# EasyEDA Pro project ProPrj_Pollux Marine Drone_2026-03-05.epro

# Schematic Schematic1
Board Name: Wristaband; Create Date: 2026-03-01; Page Name: P1; Project Name: Pollux Marine Drone; Schematic Name: Schematic1; Update Date: 2026-03-05; Company: EasyEDA.com; Page Size: A4; Version: V1.0
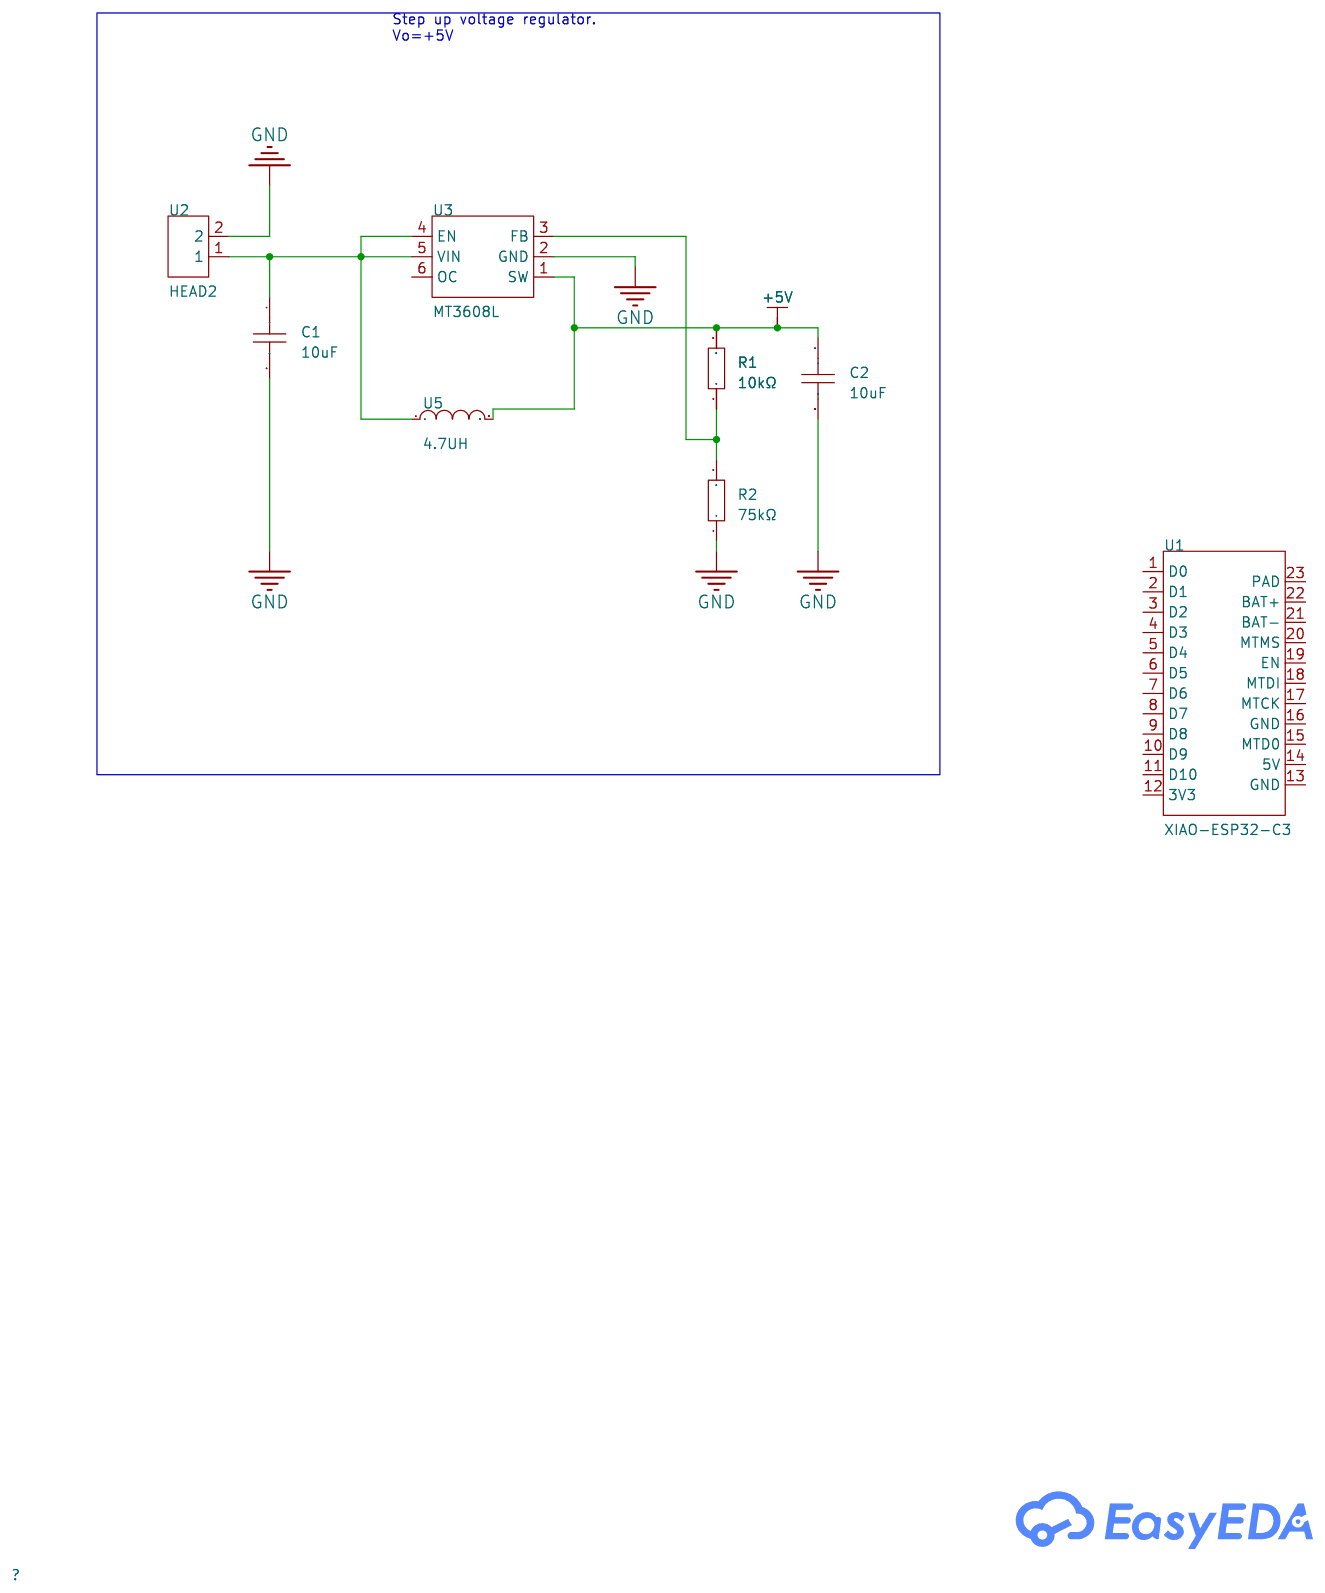
[diagram p0: schematic sheet]

## Parts
C1  10uF  [C0805]
C2  10uF  [C0805]
R1  10kΩ  [R0805]
R2  75kΩ  [R0805]
U1  XIAO-ESP32-C3  [COMM-SMD_XIAO-ESP32-C3_1]
U2  HEAD2  [HDR-TH_2P-P2.54-V-M]
U3  MT3608L  [SOT-23-6_L2.9-W1.6-P0.95-LS2.8-BL_3]
U5  4.7UH  [IND-SMD_L3.5-W3.0]

## Library data of the parts
C1 C2 = 0805X5R106K350NT: Capacitance:10uF Tolerance:±10% Tolerance:±10% Voltage Rating:35V Temperature Coefficient:X5R; LCSC Part Name: 10uF ±10% 35V; Supplier Part: C49326680; Manufacturer: AIDE(爱迪电容); Supplier Footprint: 0805; JLCPCB Part Class: Extended Part; Datasheet: https://item.szlcsc.com/datasheet/0805X5R106K350NT/51802510.html; Supplier: LCSC; Tolerance: ±10%; Voltage Rating: 35V; Temperature Coefficient: X5R
R1 R2 = 0805W8F1002T5E: Type:Thick Film Resistor Resistance:10kΩ Tolerance:±1% Tolerance:±1% Power(Watts):125mW Voltage-Supply(Max):150V Temperature Coefficient:±100ppm/℃ Temperature Coefficient:±100ppm/℃ Operating Temperature:-55℃~+155℃ Operating Temperature:-55℃~+155℃; LCSC Part Name: 10kΩ ±1% 125mW 厚膜电阻; Supplier Part: C17414; Manufacturer: UNI-ROYAL(厚声); Supplier Footprint: 0805; JLCPCB Part Class: Basic Part; Datasheet: https://item.szlcsc.com/datasheet/0805W8F1002T5E/18102.html; Supplier: LCSC; Type: Thick Film Resistor; Tolerance: ±1%; Power(Watts): 125mW; Voltage-Supply(Max): 150V; Temperature Coefficient: ±100ppm/℃; Operating Temperature: -55℃~+155℃
U1 = XIAO-ESP32-C3: Supplier Part: C9900252152; Supplier Footprint: SMD; Supplier: LCSC
U2 = HEAD2: Supplier Part: C9900010030; Supplier Footprint: HDR-TH_2P-P2.54; JLCPCB Part Class: Extended Part; Supplier: LCSC
U3 = MT3608L: Function:Boost Voltage - Supply:2.2V~16V Voltage - Supply:2.2V~16V Output Voltage:- Output Voltage:- Output Current:2.5A Frequency - Switching:1.2MHz Frequency - Switching:1.2MHz Operating Temperature:-40℃~+85℃@(TA) Operating Temperature:-40℃~+85℃@(TA) Sy; LCSC Part Name: 高效2.5A 1.2MHz升压转换器; Supplier Part: C2932326; Manufacturer: 西安航天民芯; Supplier Footprint: SOT-23-6; JLCPCB Part Class: Extended Part; Datasheet: https://item.szlcsc.com/datasheet/MT3608L/3276649.html; Supplier: LCSC; Function: Boost; Voltage - Supply: 2.2V~16V; Output Current: 2.5A; Frequency - Switching: 1.2MHz; Operating Temperature: -40℃~+85℃@(TA); Synchronous Rectifier: No; Number of Outputs: 1; Topology: Boost; Quiescent Current: 100uA; Switch tube (built-in/external): Built-In; Output Type: Adjustable
U5 = 4.7UH_C9900008595: Supplier Part: C9900008595; JLCPCB Part Class: Extended Part; Supplier: LCSC

## Nets
+5V: C2.1 R1.2 U3.1(SW) U5.2
GND: C1.2 C2.2 R2.1 U2.2 U3.2(GND)
Net-(C1-1): C1.1 U2.1 U3.4(EN) U3.5(VIN) U5.1
Net-(R1-1): R1.1 R2.2 U3.3(FB)

Not connected (* = marked no-connect by the designer): U1 1(D0) 2(D1) 3(D2) 4(D3) 5(D4) 6(D5) 7(D6) 8(D7) 9(D8) 10(D9) 11(D10) 12(3V3) 13(GND) 14(5V) 15(MTD0) 16(GND) 17(MTCK) 18(MTDI) 19(EN) 20(MTMS) 21(BAT-) 22(BAT+) 23(PAD); U3 6(OC)

## Notes on the sheet
- Step up voltage regulator.
  Vo=+5V

# Board PCB1
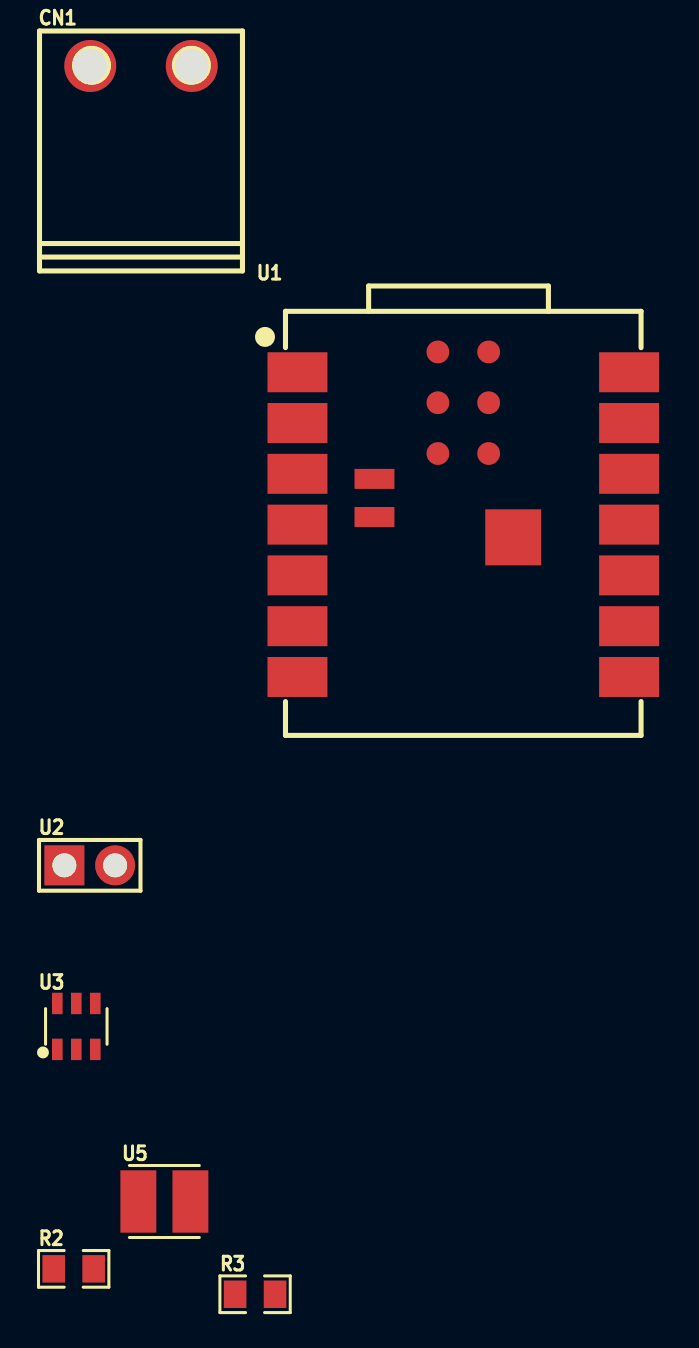
[diagram p1: board, top side]
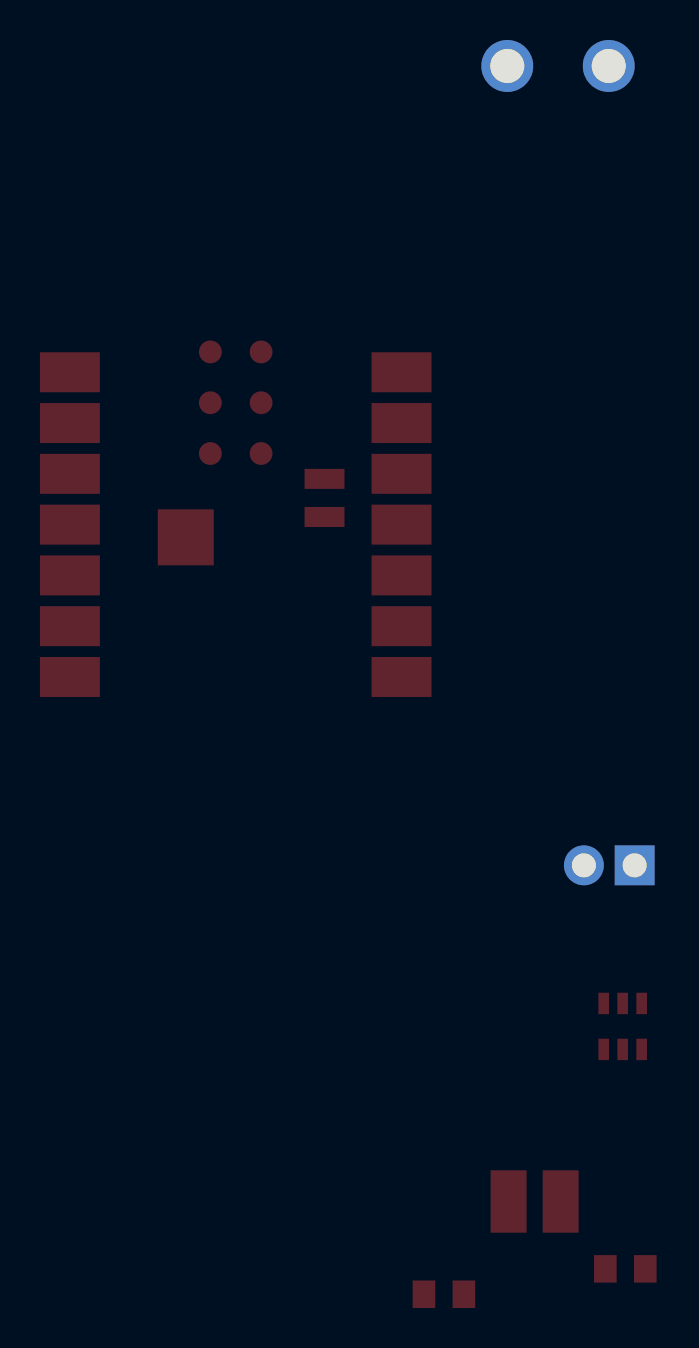
[diagram p2: board, bottom side, seen from below]

No outline. copper layers: Top Layer, Bottom Layer. Coordinates in mm from the lowest, leftmost part position.
Stack: Top Layer 0.035mm / Dielectric1 1.51mm FR4 er 4.5 / Bottom Layer 0.035mm

## Design rules (mm)
template: JLCPCB Capability(Two Layers Board)
spacing copperThickness1oz (default): track to track 0.102, other pairs 0.152 to 0.3
spacing copperThickness2oz: track to track 0.203, other pairs 0.152 to 0.3
track width copperThickness1oz (default): min 0.127, default 0.254, max 2.54
track width copperThickness2oz: min 0.203, default 0.254, max 2.54
differential pair differentialPair (default): width min 0.127, default 0.254, max 2.54; gap min 0.152, default 0.152
via viaSize (default): diameter min 0.5, default 0.61, max 10; hole min 0.3, default 0.305, max 6.3

## Placement (name value [footprint] x y rotation side)
CN1  LC-2P-S-5.08-W  [CONN-TH_2P-P5.08_2EHDR-02P]  3.37 61.43 0 top
R2  75kΩ  [R0805]  0 1.27 0 top
R3  75kΩ  [R0805]  9.08 0 0 top
U1  XIAO-ESP32-C3  [COMM-SMD_XIAO-ESP32-C3_1]  19.5 39 0 top
U2  HEAD2  [HDR-TH_2P-P2.54-V-M]  0.8 21.45 0 top
U3  MT3608L  [SOT-23-6_L2.9-W1.6-P0.95-LS2.8-BL_3]  0.13 13.39 0 top
U5  4.7UH  [IND-SMD_L3.5-W3.0]  4.54 4.64 0 top

## Footprints (pads in the part's own frame, mm; a bottom-side part is the same pattern mirrored in y, then rotated)
COMM-SMD_XIAO-ESP32-C3_1
  rect 3x2 smd: 1(-8.3,7.112) 2(-8.3,4.572) 3(-8.3,2.032) 4(-8.3,-0.508) 5(-8.3,-3.048) 6(-8.3,-5.588) 7(-8.3,-8.128) 8(8.3,-8.128) 9(8.3,-5.588) 10(8.3,-3.048) 11(8.3,-0.508) 12(8.3,2.032) 13(8.3,4.572) 14(8.3,7.112)
  round 1.143 smd: 15(1.27,8.128) 16(1.27,5.588) 17(1.27,3.048) 18(-1.27,8.128) 19(-1.27,5.588) 20(-1.27,3.048)
  rect 2x1 smd: 21(-4.445,1.778) 22(-4.445,-0.127)
  rect 2.8x2.8 smd: 23(2.5,-1.143)
CONN-TH_2P-P5.08_2EHDR-02P
  round 2.6 hole 1.7: 1(-2.54,0) 2(2.54,0)
HDR-TH_2P-P2.54-V-M
  rect 2x2 hole 1.2: 1(-1.27,0)
  round 2 hole 1.2: 2(1.27,0)
IND-SMD_L3.5-W3.0
  rect 1.8x3.12 smd: 1(1.303,0) 2(-1.303,0)
R0805
  rect 1.133x1.377 smd: 1(-1,0) 2(1,0)
SOT-23-6_L2.9-W1.6-P0.95-LS2.8-BL_3
  rect 0.532x1.072 smd: 1(-0.95,-1.149) 2(0,-1.149) 3(0.95,-1.149) 4(0.95,1.149) 5(0,1.149) 6(-0.95,1.149)

## Nets
As in the schematic.

Pads without a net: CN1 1 2; R2 1 2; R3 1 2; U1 1 2 3 4 5 6 7 8 9 10 11 12 13 14 15 16 17 18 19 20 21 22 23; U2 1 2; U3 1 2 3 4 5 6; U5 1 2
